# EAGLE schematic TinyG-Shield-for-Due (EAGLE 7.5.0)

## Sheet 1 of 2
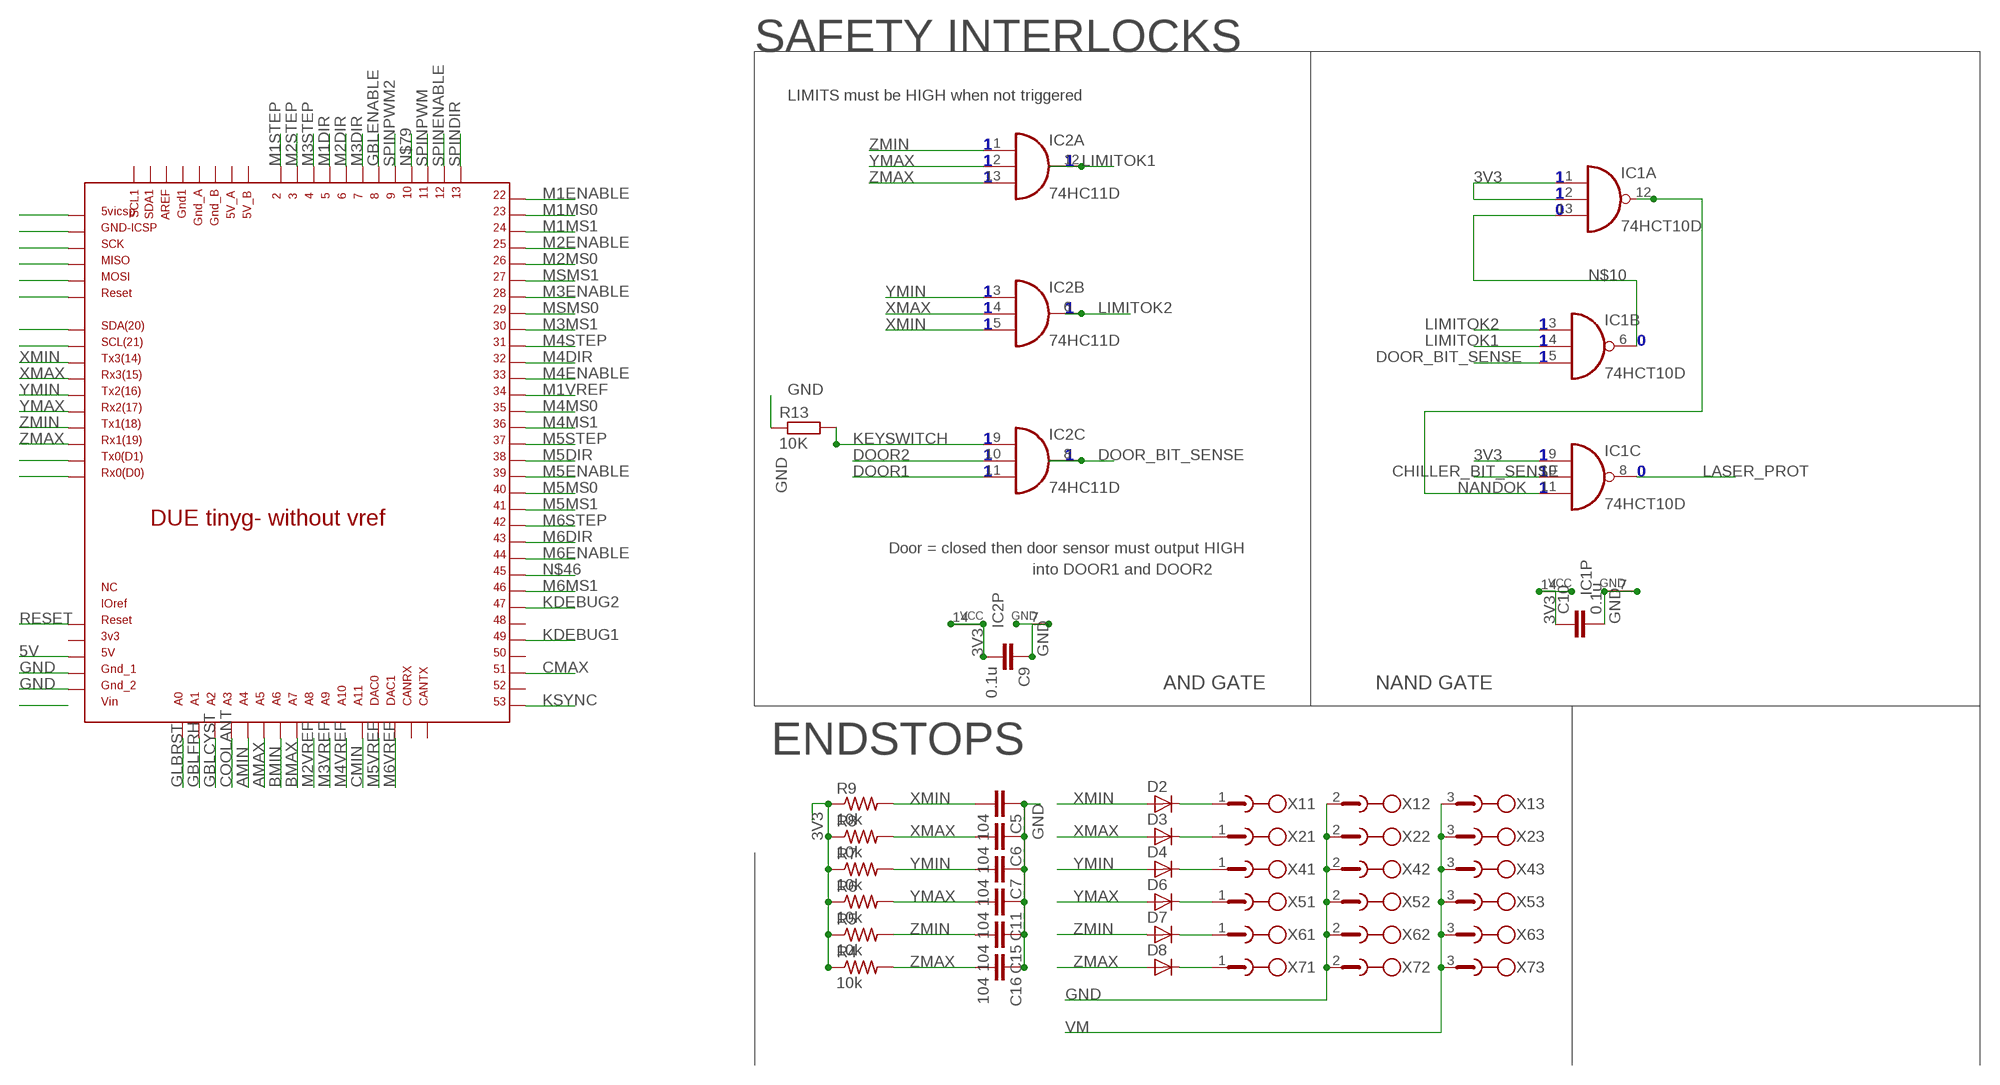
[diagram p0: schematic, sheet 1]

### Parts
C5  104  C-EUC1206  [C1206]
C6  104  C-EUC1206  [C1206]
C7  104  C-EUC1206  [C1206]
C9  0.1u  CAP1206  [1206]
C10  0.1u  CAP1206  [1206]
C11  104  C-EUC1206  [C1206]
C15  104  C-EUC1206  [C1206]
C16  104  C-EUC1206  [C1206]
D2  D-SOD-87  [SOD87]
D3  D-SOD-87  [SOD87]
D4  D-SOD-87  [SOD87]
D6  D-SOD-87  [SOD87]
D7  D-SOD-87  [SOD87]
D8  D-SOD-87  [SOD87]
IC1  74HCT10D  [SO14]
IC2  74HC11D  [SO14]
R4  10k  R-US_M1206  [M1206]
R5  10k  R-US_M1206  [M1206]
R6  10k  R-US_M1206  [M1206]
R7  10k  R-US_M1206  [M1206]
R8  10k  R-US_M1206  [M1206]
R9  10k  R-US_M1206  [M1206]
R13  10K  R-EU_M1206  [M1206]
U$1  DUE3-TINYG  [DUE-TINYG]
X1  MC1.5/3  [MC1.5/3-G-3.81]
X2  MC1.5/3  [MC1.5/3-G-3.81]
X4  MC1.5/3  [MC1.5/3-G-3.81]
X5  MC1.5/3  [MC1.5/3-G-3.81]
X6  MC1.5/3  [MC1.5/3-G-3.81]
X7  MC1.5/3  [MC1.5/3-G-3.81]

### Nets
3V3: C9.2 C10.1 IC1.1(A:I0) IC1.2(A:I1) IC1.9(C:I0) IC1.14(P:VCC) IC2.14(P:VCC) R4.1 R5.1 R6.1 R7.1 R8.1 R9.1 ; also sheet 2
5V: U$1.5V-P(5V) ; also sheet 2
AMAX: U$1.A5
AMIN: U$1.A4
BMAX: U$1.A7
BMIN: U$1.A6
CHILLER_BIT_SENSE: IC1.10(C:I1)
CMAX: U$1.51
CMIN: U$1.A11
COOLANT: U$1.A3 ; also sheet 2
DOOR1: IC2.11(C:I2) ; also sheet 2
DOOR2: IC2.10(C:I1) ; also sheet 2
DOOR_BIT_SENSE: IC1.5(B:I2) IC2.8(C:O)
GBLCYST: U$1.A2 ; also sheet 2
GBLENABLE: U$1.8
GBLFRH: U$1.A1 ; also sheet 2
GLBRST: U$1.A0 ; also sheet 2
GND: C5.1 C6.1 C7.1 C9.1 C10.2 C11.1 C15.1 C16.1 IC1.7(P:GND) IC2.7(P:GND) R13.1 U$1.GND_1 U$1.GND_2 X1.2 X2.2 X4.2 X5.2 X6.2 X7.2 ; also sheet 2
KDEBUG1: U$1.49
KDEBUG2: U$1.47
KEYSWITCH: IC2.9(C:I0) R13.2 ; also sheet 2
KSYNC: U$1.53
LASER_PROT: IC1.8(C:O) ; also sheet 2
LIMITOK1: IC1.4(B:I1) IC2.12(A:O)
LIMITOK2: IC1.3(B:I0) IC2.6(B:O)
M1DIR: U$1.5 ; also sheet 2
M1ENABLE: U$1.22 ; also sheet 2
M1MS0: U$1.23
M1MS1: U$1.24
M1STEP: U$1.2 ; also sheet 2
M1VREF: U$1.34
M2DIR: U$1.6 ; also sheet 2
M2ENABLE: U$1.25 ; also sheet 2
M2MS0: U$1.26
M2STEP: U$1.3 ; also sheet 2
M3DIR: U$1.7 ; also sheet 2
M3ENABLE: U$1.28 ; also sheet 2
M3MS1: U$1.30
M3STEP: U$1.4 ; also sheet 2
M4DIR: U$1.32 ; also sheet 2
M4ENABLE: U$1.33 ; also sheet 2
M4MS0: U$1.35
M4MS1: U$1.36
M4STEP: U$1.31 ; also sheet 2
M5DIR: U$1.38
M5ENABLE: U$1.39
M5MS0: U$1.40
M5MS1: U$1.41
M5STEP: U$1.37
M5VREF: U$1.DAC0
M6DIR: U$1.43
M6ENABLE: U$1.44
M6MS1: U$1.46
M6STEP: U$1.42
M6VREF: U$1.DAC1
MSMS0: U$1.29
MSMS1: U$1.27
N$1: U$1.5V_ICSP
N$2: U$1.GND_ICSP
N$3: U$1.SCK_ICSP
N$4: U$1.MISO_ICSP
N$5: U$1.MOSI_ICSP
N$6: U$1.RESET_ICSP
N$7: U$1.SDA
N$8: U$1.SCL
N$10: IC1.6(B:O) IC1.13(A:I2)
N$11: D2.1(C) X1.1
N$12: D3.1(C) X2.1
N$13: D4.1(C) X4.1
N$14: D6.1(C) X5.1
N$15: U$1.TX0
N$16: U$1.RX0
N$23: D7.1(C) X6.1
N$24: D8.1(C) X7.1
N$46: U$1.45
N$79: U$1.10
NANDOK: IC1.11(C:I2) IC1.12(A:O)
RESET: U$1.RESET ; also sheet 2
SPINDIR: U$1.13 ; also sheet 2
SPINENABLE: U$1.12 ; also sheet 2
SPINPWM: U$1.11 ; also sheet 2
SPINPWM2: U$1.9
VM: X1.3 X2.3 X4.3 X5.3 X6.3 X7.3 ; also sheet 2
XMAX: C6.2 D3.2(A) IC2.4(B:I1) R8.2 U$1.RX3
XMIN: C5.2 D2.2(A) IC2.5(B:I2) R9.2 U$1.TX3
YMAX: C11.2 D6.2(A) IC2.2(A:I1) R6.2 U$1.RX2
YMIN: C7.2 D4.2(A) IC2.3(B:I0) R7.2 U$1.TX2
ZMAX: C16.2 D8.2(A) IC2.13(A:I2) R4.2 U$1.RX1
ZMIN: C15.2 D7.2(A) IC2.1(A:I0) R5.2 U$1.TX1
Unconnected: U$1.3V3 U$1.5V_A U$1.5V_B U$1.48 U$1.50 U$1.52 U$1.AREF U$1.CANRX U$1.CANTX U$1.GND1 U$1.GND_A U$1.GND_B U$1.SCL1 U$1.SDA1

### Notes on the sheet
- SAFETY INTERLOCKS
- BLUE=ALL-OK LOGIC
- LIMITS must be HIGH when not triggered
- 1
- 1
- 1 | 1 | 1 | 1 | 1
- 1 | 1
- 1 | 1 | 1 | 1
- 0
- 0
- 1
- 1
- 1 | 1 | 1 | 1 | 1
- 1 | 1
- 1 | 1 | 1 | 0 | 0
- 1
- 1
- 1
- 1 | 1
- 1 | 1 | 1 | 1 | 1
- 1 | 1 | 1 | 0 | 0
- 1 | 1
- 1
- Door = closed then door sensor must output HIGH
- into DOOR1 and DOOR2
- AND GATE | NAND GATE
- ENDSTOPS | LED
- 1 | 1

## Sheet 2 of 2
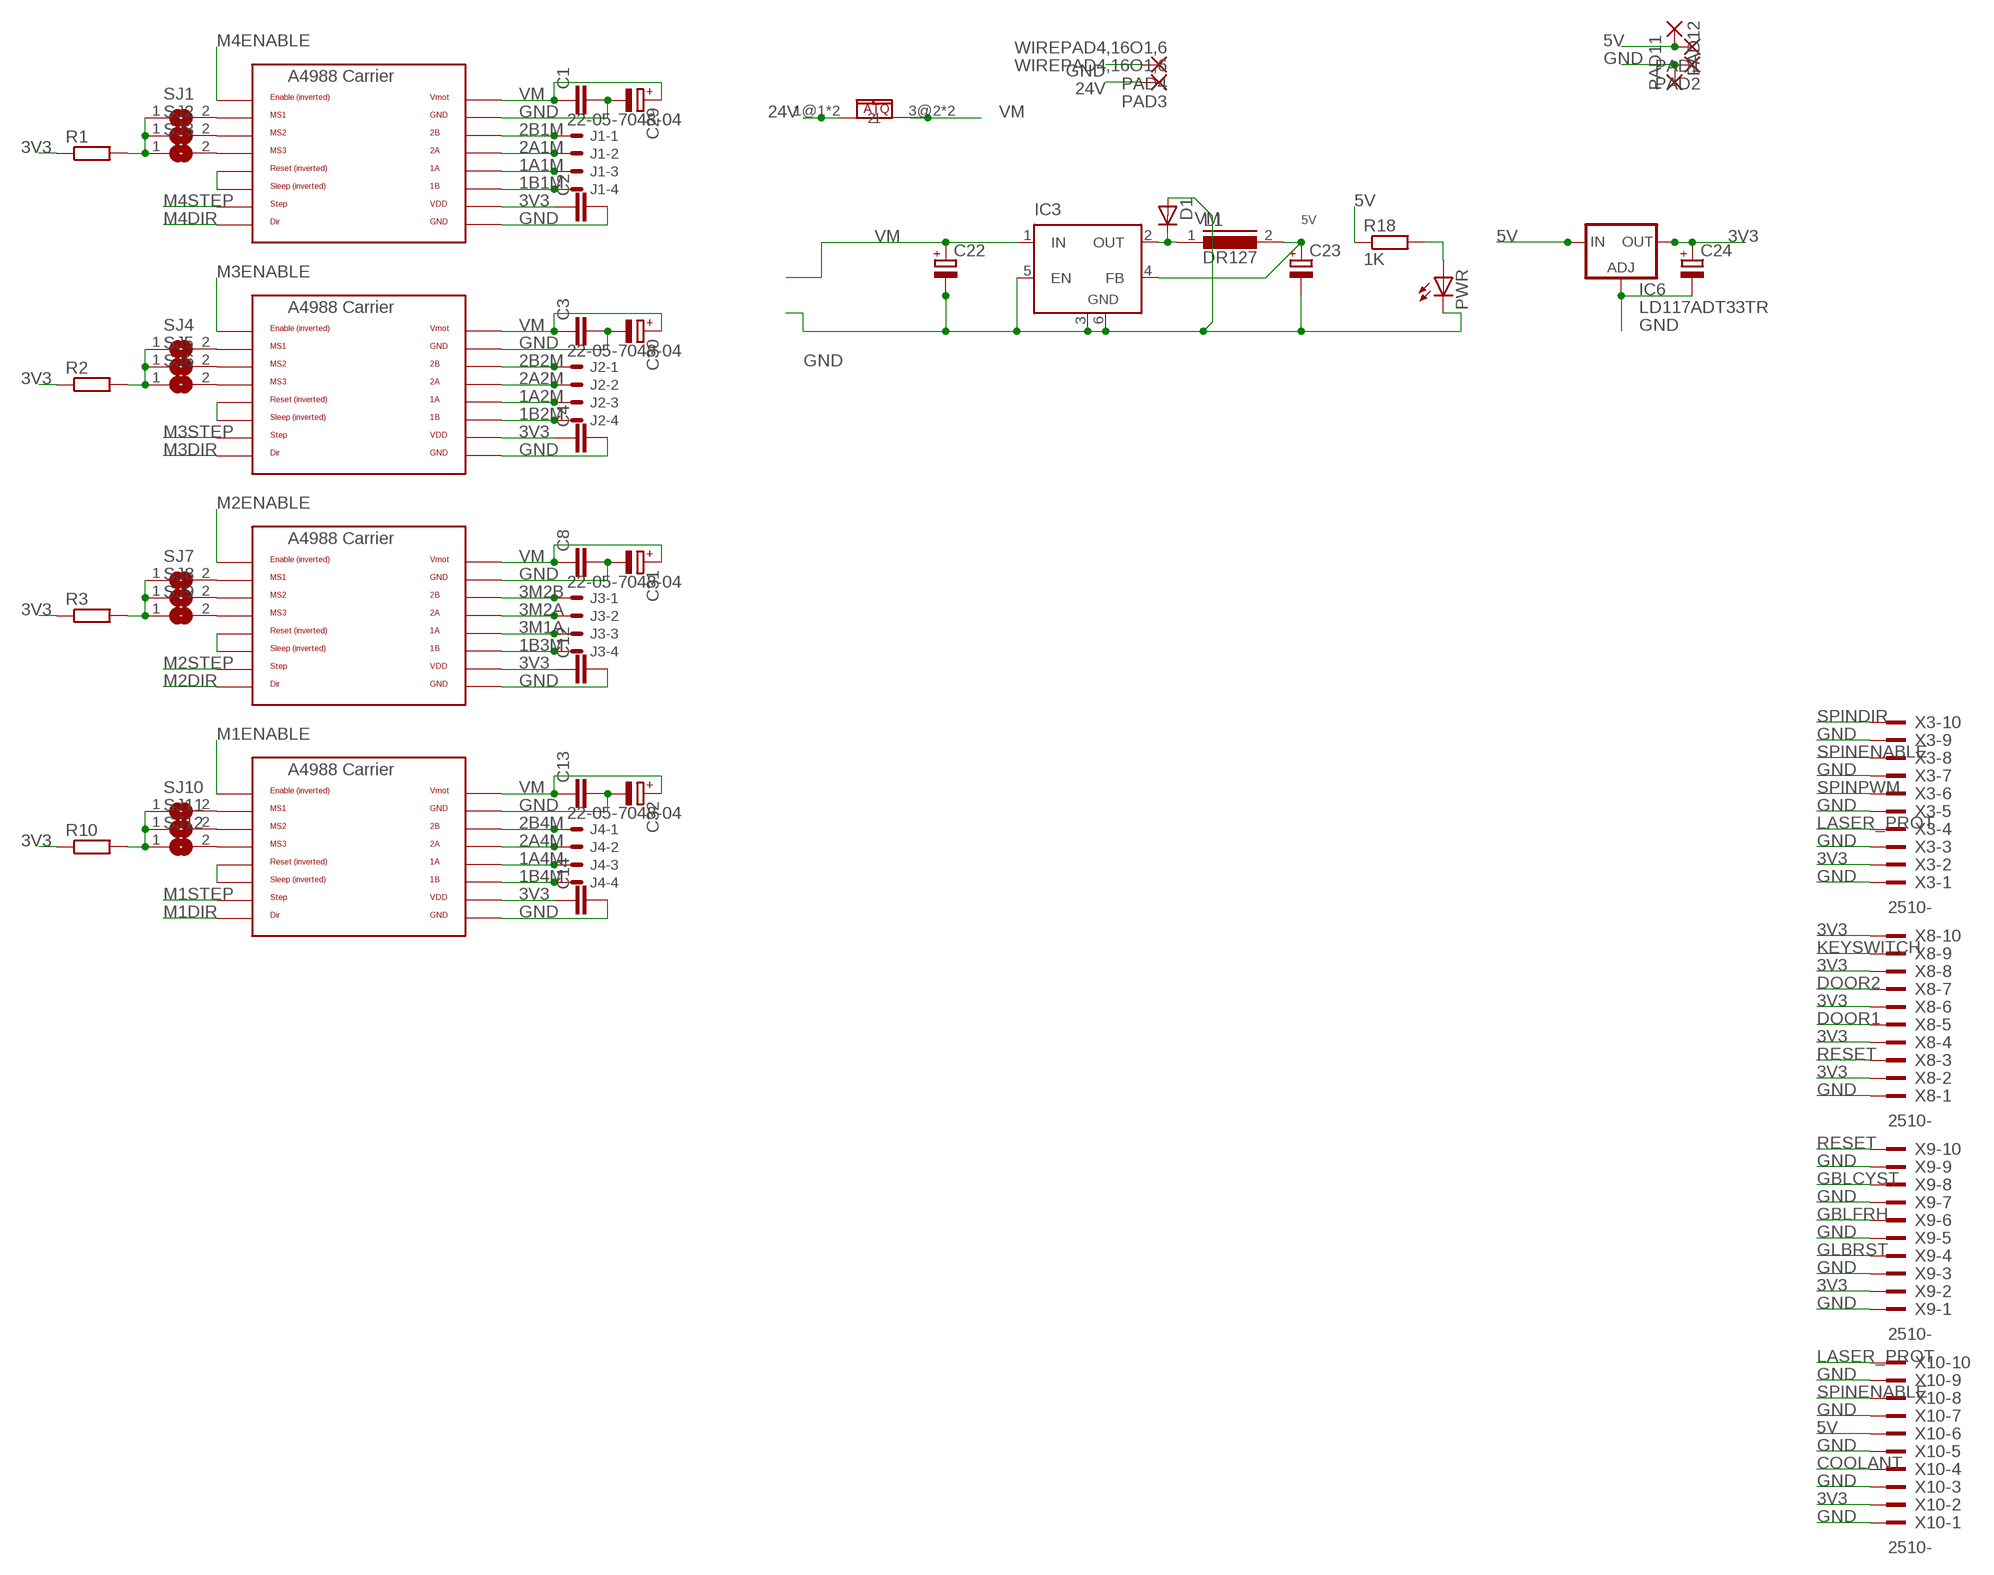
[diagram p1: schematic, sheet 2]

### Parts
C1  C-EUC1206  [C1206]
C2  C-EUC1206  [C1206]
C3  C-EUC1206  [C1206]
C4  C-EUC1206  [C1206]
C8  C-EUC1206  [C1206]
C12  C-EUC1206  [C1206]
C13  C-EUC1206  [C1206]
C14  C-EUC1206  [C1206]
C22  CPOL-EUE  [PANASONIC_E]
C23  CPOL-EUE  [PANASONIC_E]
C24  CPOL-EUD  [PANASONIC_D]
C29  CPOL-EUE2,5-6E  [E2,5-6E]
C30  CPOL-EUE2,5-6E  [E2,5-6E]
C31  CPOL-EUE2,5-6E  [E2,5-6E]
C32  CPOL-EUE2,5-6E  [E2,5-6E]
D1  D-SOD-87  [SOD87]
IC3  LM2596S  [TO263-5]
IC6  LD117ADT33TR  [DPACK]
J1  22-05-7048-04  [7395-04]
J2  22-05-7048-04  [7395-04]
J3  22-05-7048-04  [7395-04]
J4  22-05-7048-04  [7395-04]
L1  DR127  [DR127]
PAD1  3,81/1,4  [3,81/1,4]
PAD2  3,81/1,4  [3,81/1,4]
PAD3  WIREPAD4,16O1,6  [4,16O1,6]
PAD4  WIREPAD4,16O1,6  [4,16O1,6]
PAD11  3,81/1,4  [3,81/1,4]
PAD12  3,81/1,4  [3,81/1,4]
PWR  LEDCHIPLED_1206  [CHIPLED_1206]
R1  R-EU_0207/7  [0207/7]
R2  R-EU_0204/7  [0204/7]
R3  R-EU_0207/7  [0207/7]
R10  R-EU_0207/7  [0207/7]
R18  1K  R-EU_M1206  [M1206]
SJ1  SJ  [SJ]
SJ2  SJ  [SJ]
SJ3  SJ  [SJ]
SJ4  SJ  [SJ]
SJ5  SJ  [SJ]
SJ6  SJ  [SJ]
SJ7  SJ  [SJ]
SJ8  SJ  [SJ]
SJ9  SJ  [SJ]
SJ10  SJ  [SJ]
SJ11  SJ  [SJ]
SJ12  SJ  [SJ]
U$3  POLOLU_A4983CARRIER  [A4988BREAKOUT]
U$4  POLOLU_A4983CARRIER  [A4988BREAKOUT]
U$5  POLOLU_A4983CARRIER  [A4988BREAKOUT]
U$6  POLOLU_A4983CARRIER  [A4988BREAKOUT]
U$7  CQ-121  [CQ121]
X3  2510-  [PAK100/2500-10]
X8  2510-  [PAK100/2500-10]
X9  2510-  [PAK100/2500-10]
X10  2510-  [PAK100/2500-10]

### Nets
1A1M: J1.3 U$3.1A
1A2M: J2.3 U$4.1A
1A4M: J4.3 U$6.1A
1B1M: J1.4 U$3.1B
1B2M: J2.4 U$4.1B
1B3M: J3.4 U$5.1B
1B4M: J4.4 U$6.1B
2A1M: J1.2 U$3.2A
2A2M: J2.2 U$4.2A
2A4M: J4.2 U$6.2A
2B1M: J1.1 U$3.2B
2B2M: J2.1 U$4.2B
2B4M: J4.1 U$6.2B
3M1A: J3.3 U$5.1A
3M2A: J3.2 U$5.2A
3M2B: J3.1 U$5.2B
3V3: C2.1 C4.1 C12.1 C14.1 C24.+ IC6.4(OUT) R1.1 R2.1 R3.1 R10.1 U$3.VDD U$4.VDD U$5.VDD U$6.VDD X3.2 X8.2 X8.4 X8.6 X8.8 X8.10 X9.2 X10.2 ; also sheet 1
5V: C23.+ IC3.4(FB) IC6.3(IN) L1.2 PAD1.1(P) PAD12.1(P) R18.1 X10.6 ; also sheet 1
24V: PAD3.1(P) U$7.1@1 U$7.2@1
COOLANT: X10.4 ; also sheet 1
DOOR1: X8.5 ; also sheet 1
DOOR2: X8.7 ; also sheet 1
GBLCYST: X9.8 ; also sheet 1
GBLFRH: X9.6 ; also sheet 1
GLBRST: X9.4 ; also sheet 1
GND: C1.2 C2.2 C3.2 C4.2 C8.2 C12.2 C13.2 C14.2 C22.- C23.- C24.- C29.- C30.- C31.- C32.- D1.2(A) IC3.3(GND) IC3.5(EN) IC3.6(GND) IC6.1(ADJ) PAD2.1(P) PAD4.1(P) PAD11.1(P) PWR.C U$3.GND U$3.GND@0(GND) U$4.GND U$4.GND@0(GND) U$5.GND U$5.GND@0(GND) U$6.GND U$6.GND@0(GND) X3.1 X3.3 X3.5 X3.7 X3.9 X8.1 X9.1 X9.3 X9.5 X9.7 X9.9 X10.1 X10.3 X10.5 X10.7 X10.9 ; also sheet 1
KEYSWITCH: X8.9 ; also sheet 1
LASER_PROT: X3.4 X10.10 ; also sheet 1
M1DIR: U$6.DIR ; also sheet 1
M1ENABLE: U$6.EN ; also sheet 1
M1STEP: U$6.STEP ; also sheet 1
M2DIR: U$5.DIR ; also sheet 1
M2ENABLE: U$5.EN ; also sheet 1
M2STEP: U$5.STEP ; also sheet 1
M3DIR: U$4.DIR ; also sheet 1
M3ENABLE: U$4.EN ; also sheet 1
M3STEP: U$4.STEP ; also sheet 1
M4DIR: U$3.DIR ; also sheet 1
M4ENABLE: U$3.EN ; also sheet 1
M4STEP: U$3.STEP ; also sheet 1
N$25: U$4.RST U$4.SLP(SLEEP)
N$26: SJ1.2 U$3.MS1
N$27: SJ2.2 U$3.MS2
N$28: SJ3.2 U$3.MS3
N$29: R1.2 SJ1.1 SJ2.1 SJ3.1
N$30: SJ4.2 U$4.MS1
N$31: SJ5.2 U$4.MS2
N$32: SJ6.2 U$4.MS3
N$33: R2.2 SJ4.1 SJ5.1 SJ6.1
N$34: U$5.RST U$5.SLP(SLEEP)
N$35: U$3.RST U$3.SLP(SLEEP)
N$36: SJ7.2 U$5.MS1
N$37: SJ8.2 U$5.MS2
N$38: SJ9.2 U$5.MS3
N$39: R3.2 SJ7.1 SJ8.1 SJ9.1
N$40: U$6.RST U$6.SLP(SLEEP)
N$41: SJ10.2 U$6.MS1
N$42: SJ11.2 U$6.MS2
N$43: SJ12.2 U$6.MS3
N$44: R10.2 SJ10.1 SJ11.1 SJ12.1
N$45: D1.1(C) IC3.2(OUT) L1.1
N$47: PWR.A R18.2
RESET: X8.3 X9.10 ; also sheet 1
SPINDIR: X3.10 ; also sheet 1
SPINENABLE: X3.8 X10.8 ; also sheet 1
SPINPWM: X3.6 ; also sheet 1
VM: C1.1 C3.1 C8.1 C13.1 C22.+ C29.+ C30.+ C31.+ C32.+ IC3.1(IN) U$3.VMOT U$4.VMOT U$5.VMOT U$6.VMOT U$7.3@2 U$7.4@2 ; also sheet 1

### Notes on the sheet
- BLUE=ALL-OK LOGIC
- 1
- 1 | 1 | 1
- 1 | 1 | 1
- 0
- 1
- 1 | 1 | 1
- 1 | 1 | 0
- 1
- 1
- 1
- 1 | 1
- 1 | 0
- 1
- 1
- LED
- 1 | 1

## Library data of the parts
C1-C8 C11-C16 = rcl:C-EU: CAPACITOR, European symbol
C9 C10 = SparkFun-Passives:CAP: Capacitor Standard 0603 ceramic capacitor, and 0.1" leaded capacitor.
C22 C23 = resistor:CPOL-EU: POLARIZED CAPACITOR, European symbol
C24 C29-C32 = rcl:CPOL-EU: POLARIZED CAPACITOR, European symbol
D1-D4 D6-D8 = semicon-smd-ipc:D-: DIODE unfilled
IC1 = 74xx-eu:74*10: Triple 3-input NAND gate
IC2 = 74xx-eu:74*11: Triple 3-input AND gate
IC3 = linear:LM2596S: STEP-DOWN VOLTAGE REGULATOR
IC6 = v-reg:LD117A?*: Low drop fixed and adjustable positive voltage regulators 1 A Source: http://www.st.com/stonline/products/literature/ds/7194/ld1117axx.pdf
J1-J4 = con-molex:22-?-04: CONNECTOR wire to board 2.54 mm (.1 inch) pitch header; OC_FARNELL: unknown; OC_NEWARK: unknown
L1 = inductors:DR127: High Power Density, High Efficiency, Shielded Inductors Source: coiltronics_dr_series.pdf
PAD1 PAD2 PAD11 PAD12 = wirepad:3,81/1,4: THROUGH-HOLE PAD
PAD3 PAD4 = wirepad:WIREPAD: Wire PAD connect wire on PCB
PWR = RepRapjr:LED: LED OSRAM: - CHIPLED LG R971, LG N971, LY N971, LG Q971, LY Q971, LO R971, LY R971 LH N974, LH R974 LS Q976, LO Q976, LY Q976 LO Q996 - Hyper CHIPLED LW Q18S LB Q993, LB Q99A, LB R99A - SideLED LS A670, LO A670, LY A670, LG A670, LP A670 LB A673, LV A673, LT A673, LW A673 LH A674 LY A675 LS A676, LA A676, LO A676, LY A676, LW A676 LS A679, LY A679, LG A679 - Hyper Micro SIDELED® LS Y876, LA Y876, LO Y876, LY Y876 LT Y87S - SmartLED LW L88C, LW L88S LB L89C, LB L89S, LG L890 LS L89K, LO L89K, LY L89K LS L896, LA L896, LO L896, LY L896 - TOPLED LS T670, LO T670, LY T670, LG T670, LP T670 LSG T670, LSP T670, LSY T670, LOP T670, LYG T670 LG T671, LOG T671, LSG T671 LB T673, LV T673, LT T673, LW T673 LH T674 LS T676, LA T676, LO T676, LY T676, LB T676, LH T676, LSB T676, LW T676 LB T67C, LV T67C, LT T67C, LS T67K, LO T67K, LY T67K, LW E67C LS E67B, LA E67B, LO E67B, LY E67B, LB E67C, LV E67C, LT E67C LW T67C LS T679, LY T679, LG T679 LS T770, LO T770, LY T770, LG T770, LP T770 LB T773, LV T773, LT T773, LW T773 LH T774 LS E675, LA E675, LY E675, LS T675 LS T776, LA T776, LO T776, LY T776, LB T776 LHGB T686 LT T68C, LB T68C - Hyper Mini TOPLED® LB M676 - Mini TOPLED Santana® LG M470 LS M47K, LO M47K, LY M47K Source: http://www.osram.convergy.de LUXEON: - LUMILED® LXK2-PW12-R00, LXK2-PW12-S00, LXK2-PW14-U00, LXK2-PW14-V00 LXK2-PM12-R00, LXK2-PM12-S00, LXK2-PM14-U00 LXK2-PE12-Q00, LXK2-PE12-R00, LXK2-PE12-S00, LXK2-PE14-T00, LXK2-PE14-U00 LXK2-PB12-K00, LXK2-PB12-L00, LXK2-PB12-M00, LXK2-PB14-N00, LXK2-PB14-P00, LXK2-PB14-Q00 LXK2-PR12-L00, LXK2-PR12-M00, LXK2-PR14-Q00, LXK2-PR14-R00 LXK2-PD12-Q00, LXK2-PD12-R00, LXK2-PD12-S00 LXK2-PH12-R00, LXK2-PH12-S00 LXK2-PL12-P00, LXK2-PL12-Q00, LXK2-PL12-R00 Source: www.luxeon.com KINGBRIGHT: KA-3528ASYC Source: www.kingbright.com
R1-R3 R10 R18 = rcl:R-EU_: RESISTOR, European symbol
R4-R9 = adafruit:R-US_: RESISTOR, American symbol
R13 = resistor:R-EU_: RESISTOR, European symbol
SJ1-SJ12 = jumper:SJ: SMD solder JUMPER
U$1 = DUElib130425:DUE3-TINYG
U$3-U$6 = RepRapjr:POLOLU_A4983CARRIER
U$7 = Mantech.co.za:CQ-121
X1 X2 X4-X7 = jt-con-phoenix-3.81:MC1.5/3: PHOENIX
X3 X8-X10 = con-3m:2510-: 3M (TM) Pak 100 4-Wall Header Source: 3M; MF: 3M; MPN: 2510-6002UB; OC_FARNELL: 9838244; OC_NEWARK: 46F4725

## Net classes
1 power: width 0.6 mm, clearance 0.305 mm